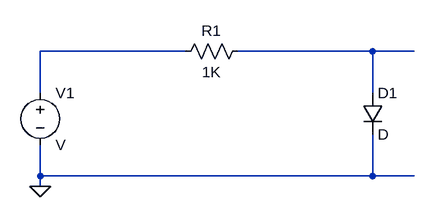
[diagram p0: schematic Germanium Diode.asc]
Germanium Diode.asc, the LTspice schematic file:
Version 4
SHEET 1 880 680
WIRE -1872 -2352 -2096 -2352
WIRE -1584 -2352 -1792 -2352
WIRE -1520 -2352 -1584 -2352
WIRE -2096 -2288 -2096 -2352
WIRE -1584 -2288 -1584 -2352
WIRE -2096 -2160 -2096 -2208
WIRE -1584 -2160 -1584 -2224
WIRE -1584 -2160 -2096 -2160
WIRE -1520 -2160 -1584 -2160
WIRE -2096 -2144 -2096 -2160
FLAG -2096 -2144 0
SYMBOL res -1776 -2368 R90
WINDOW 0 0 56 VBottom 2
WINDOW 3 32 56 VTop 2
SYMATTR InstName R1
SYMATTR Value 1K
SYMATTR SpiceLine tol=1 pwr=0.1
SYMBOL voltage -2096 -2304 R0
SYMATTR InstName V1
SYMBOL diode -1600 -2288 R0
SYMATTR InstName D1

The netlist it stands for:
* Germanium Diode.asc
R1 N002 N001 1K tol=1 pwr=0.1
V1 N001 0 V
D1 N002 0 D
.model D D
.lib standard.dio
.backanno
.end